# EAGLE schematic board (EAGLE 9.5.2)

## Sheet 1 of 2: USB
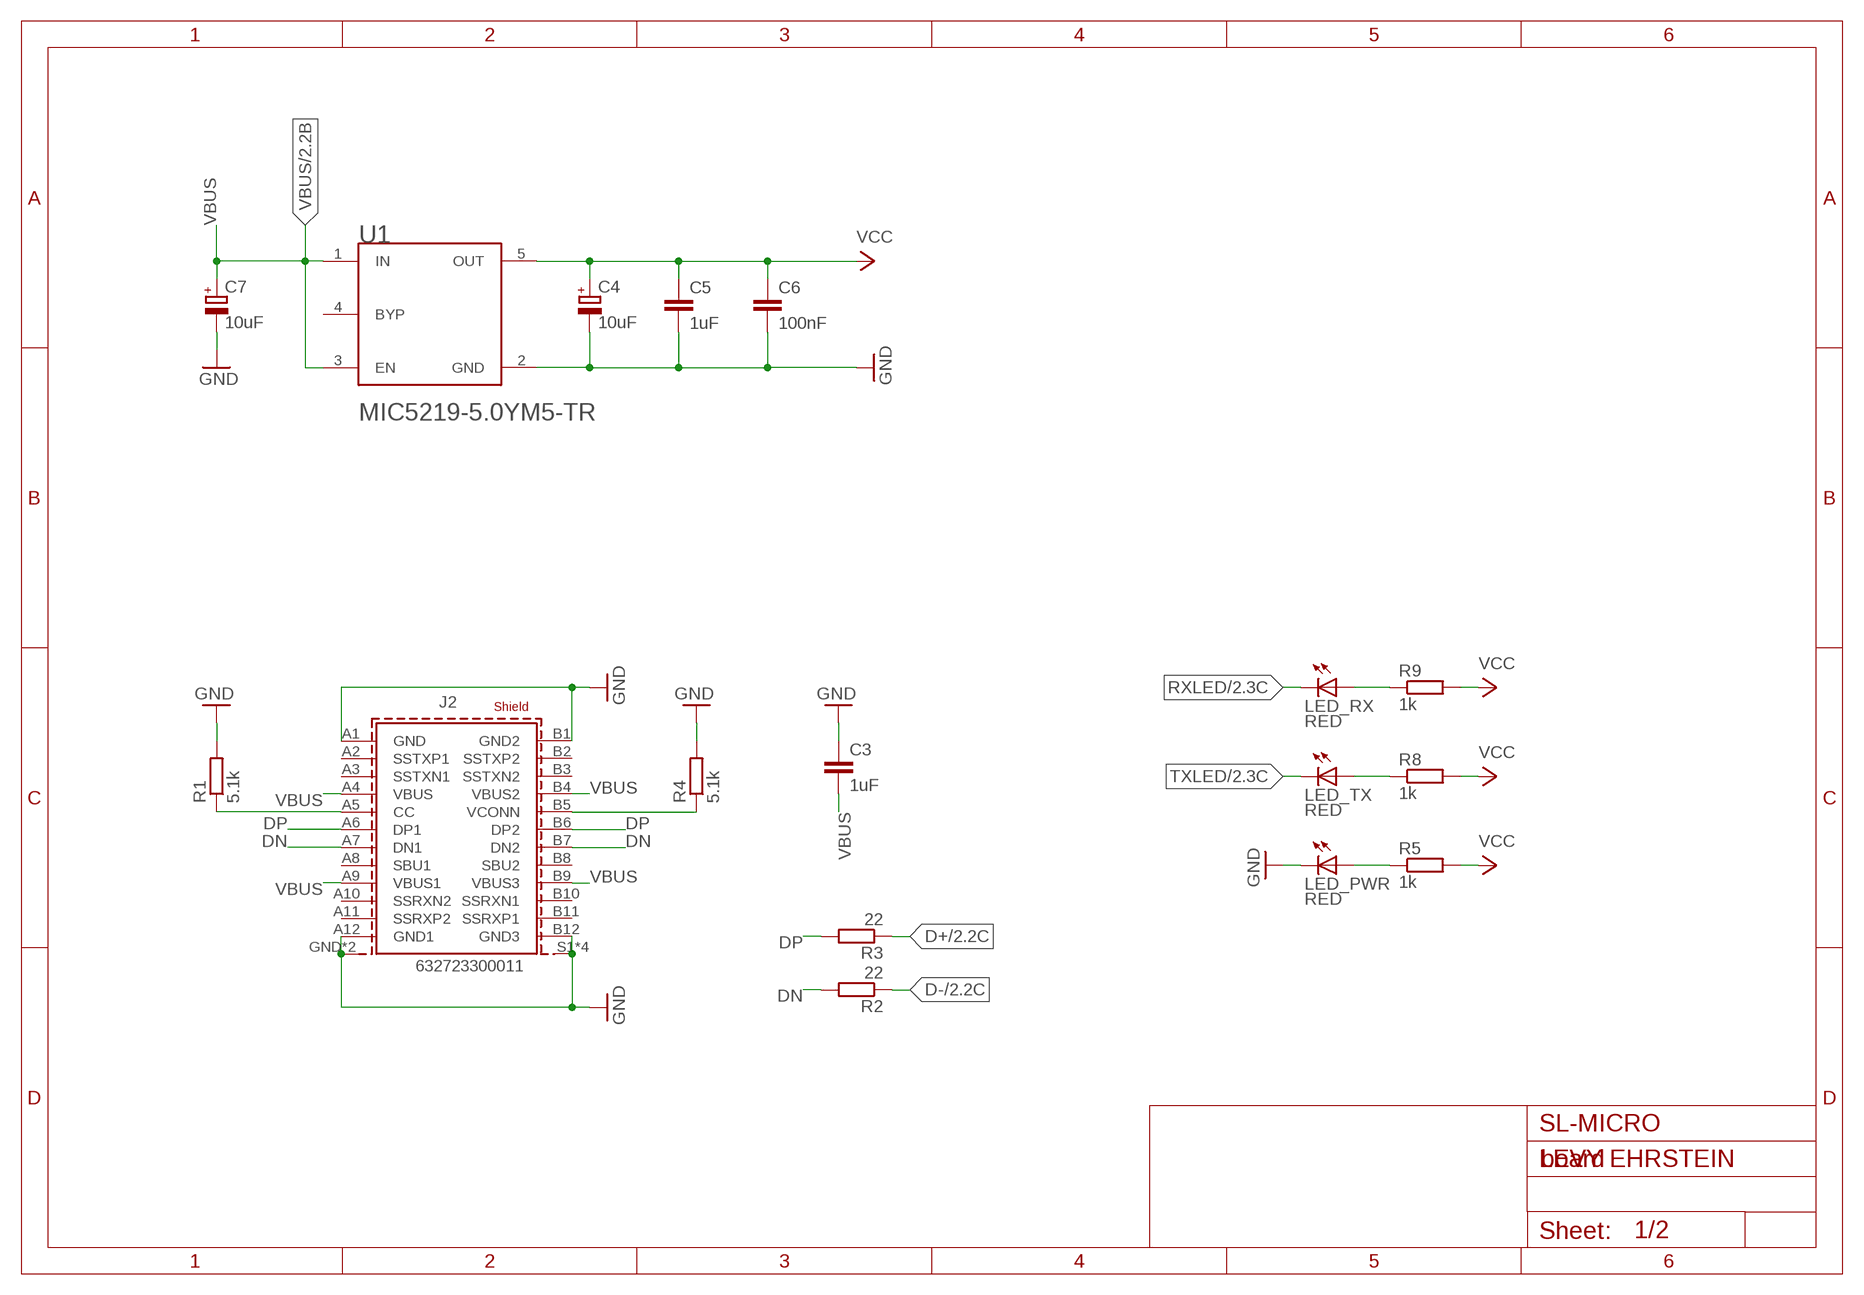
[diagram p0: schematic, sheet 1]

### Parts
C3  1uF  C-EUC0805  [C0805]
C4  10uF  CPOL-EUSMCB  [SMC_B]
C5  1uF  C-EUC0805  [C0805]
C6  100nF  C-EUC0805  [C0805]
C7  10uF  CPOL-EUSMCB  [SMC_B]
J2  632723300011  632723300011  [632723300011]
LED_PWR  RED  LEDCHIP-LED0805  [CHIP-LED0805]
LED_RX  RED  LEDCHIP-LED0805  [CHIP-LED0805]
LED_TX  RED  LEDCHIP-LED0805  [CHIP-LED0805]
R1  5.1k  R-EU_R0805  [R0805]
R2  22  R-EU_R0805  [R0805]
R3  22  R-EU_R0805  [R0805]
R4  5.1k  R-EU_R0805  [R0805]
R5  1k  R-EU_R0805  [R0805]
R8  1k  R-EU_R0805  [R0805]
R9  1k  R-EU_R0805  [R0805]
U1  MICROCHIP_TECHNOLOGY_MIC5219-5_0YM5-TRMICROCHIP_TECHNOLOGY_MIC5219-5_0YM5-TR_0_0  [MICROCHIP_TECHNOLOGY_MIC5219-5_0YM5-TR_0]

### Nets
D+: R3.1 ; also sheet 2
D-: R2.1 ; also sheet 2
DN: J2.A7(DN1) J2.B7(DN2) R2.2
DP: J2.A6(DP1) J2.B6(DP2) R3.2
GND: C3.1 C4.- C5.2 C6.2 C7.- J2.A1(GND) J2.A12(GND1) J2.B1(GND2) J2.B12(GND3) J2.GND1(SHIELD) J2.GND(SHIELD) J2.S1(SHIELD1) J2.S2(SHIELD1) J2.S3(SHIELD1) J2.S4(SHIELD1) LED_PWR.C R1.2 R4.2 U1.2(GND) ; also sheet 2
N$1: J2.A5(CC) R1.1
N$2: J2.B5(VCONN) R4.1
N$4: LED_PWR.A R5.1
N$11: LED_TX.A R8.1
N$12: LED_RX.A R9.1
RXLED: LED_RX.C ; also sheet 2
TXLED: LED_TX.C ; also sheet 2
VBUS: C3.2 C7.+ J2.A4(VBUS) J2.A9(VBUS1) J2.B4(VBUS2) J2.B9(VBUS3) U1.1(IN) U1.3(EN) ; also sheet 2
VCC: C4.+ C5.1 C6.1 R5.2 R8.2 R9.2 U1.5(OUT) ; also sheet 2
Unconnected: J2.A2(SSTXP1) J2.A3(SSTXN1) J2.A8(SBU1) J2.A10(SSRXN2) J2.A11(SSRXP2) J2.B2(SSTXP2) J2.B3(SSTXN2) J2.B8(SBU2) J2.B10(SSRXN1) J2.B11(SSRXP1) U1.4(BYP)

### Notes on the sheet
- SL-MICRO
- LEVY EHRSTEIN

## Sheet 2 of 2: ATMEGA
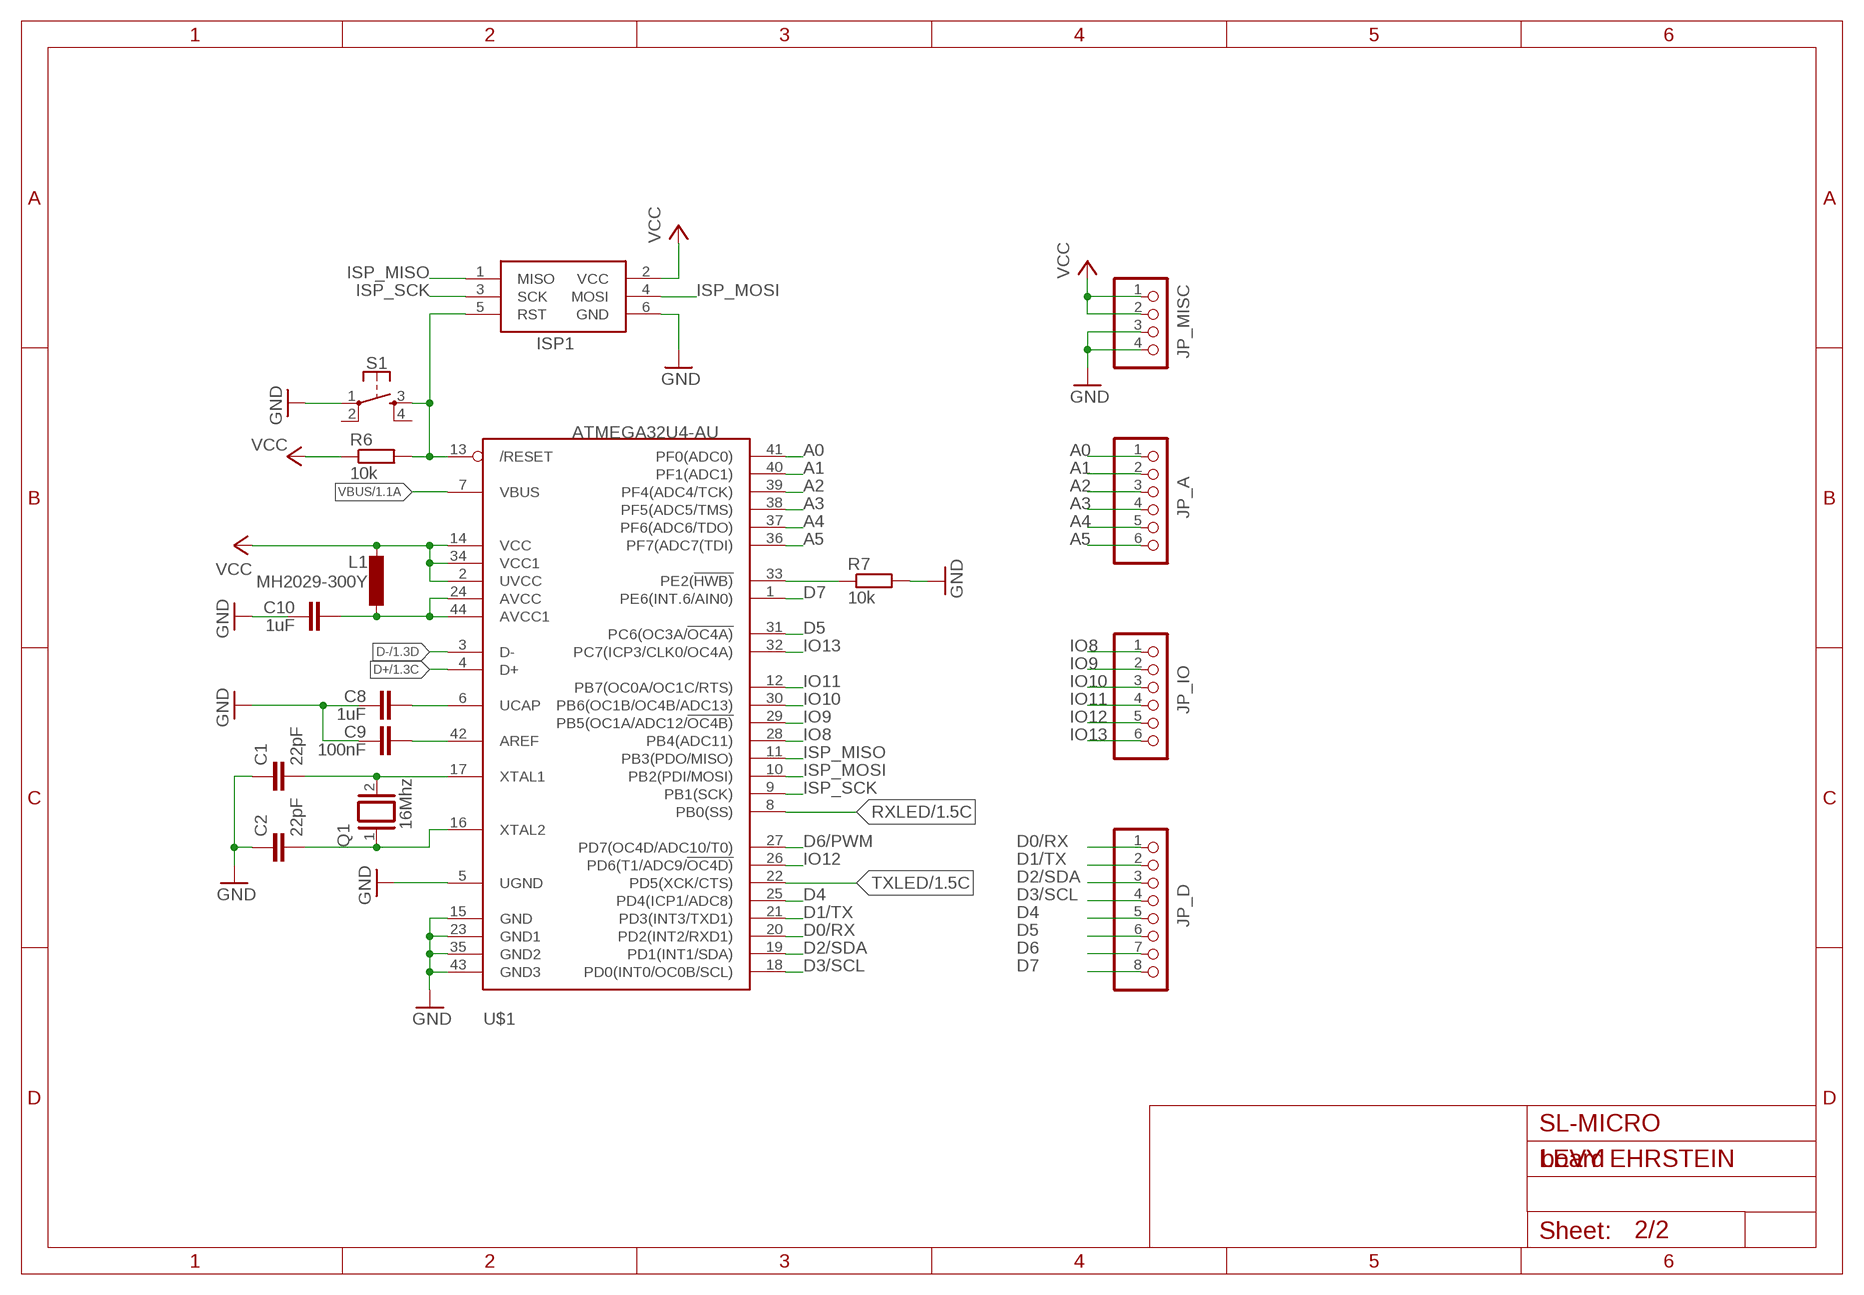
[diagram p1: schematic, sheet 2]

### Parts
C1  22pF  C-EUC0805  [C0805]
C2  22pF  C-EUC0805  [C0805]
C8  1uF  C-EUC0805  [C0805]
C9  100nF  C-EUC0805  [C0805]
C10  1uF  C-EUC0805  [C0805]
ISP1  AVRISP-6  [AVRISP]
JP_A  PINHD-1X6  [1X06]
JP_D  PINHD-1X8  [1X08]
JP_IO  PINHD-1X6  [1X06]
JP_MISC  PINHD-1X4  [1X04]
L1  MH2029-300Y  L-EUL2012C  [L2012C]
Q1  16Mhz  XTAL/S  [QS]
R6  10k  R-EU_R0805  [R0805]
R7  10k  R-EU_R0805  [R0805]
S1  MOMENTARY-SWITCH-SPST-2-SMD-4.6X2.8MM  [TACTILE_SWITCH_SMD_4.6X2.8MM]
U$1  ATMEGA32U4-AU  [TQFP44]

### Nets
A0: JP_A.1 U$1.41(PF0(ADC0))
A1: JP_A.2 U$1.40(PF1(ADC1))
A2: JP_A.3 U$1.39(PF4(ADC4/TCK))
A3: JP_A.4 U$1.38(PF5(ADC5/TMS))
A4: JP_A.5 U$1.37(PF6(ADC6/TDO))
A5: JP_A.6 U$1.36(PF7(ADC7(TDI))
D0/RX: JP_D.1 U$1.20(PD2(INT2/RXD1))
D1/TX: JP_D.2 U$1.21(PD3(INT3/TXD1))
D2/SDA: JP_D.3 U$1.19(PD1(INT1/SDA))
D3/SCL: JP_D.4 U$1.18(PD0(INT0/OC0B/SCL))
D4: JP_D.5 U$1.25(PD4(ICP1/ADC8))
D5: JP_D.6 U$1.31(PC6(OC3A/!OC4A))
D6: JP_D.7
D6/PWM: U$1.27(PD7(OC4D/ADC10/T0))
D7: JP_D.8 U$1.1(PE6(INT.6/AIN0))
D+: U$1.4(D+) ; also sheet 1
D-: U$1.3(D-) ; also sheet 1
GND: C1.1 C2.1 C8.1 C9.1 C10.1 ISP1.6(GND) JP_MISC.3 JP_MISC.4 R7.2 S1.1 U$1.5(UGND) U$1.15(GND) U$1.23(GND1) U$1.35(GND2) U$1.43(GND3) ; also sheet 1
IO8: JP_IO.1 U$1.28(PB4(ADC11))
IO9: JP_IO.2 U$1.29(PB5(OC1A/ADC12/!OC4B))
IO10: JP_IO.3 U$1.30(PB6(OC1B/OC4B/ADC13))
IO11: JP_IO.4 U$1.12(PB7(OC0A/OC1C/RTS))
IO12: JP_IO.5 U$1.26(PD6(T1/ADC9/!OC4D))
IO13: JP_IO.6 U$1.32(PC7(ICP3/CLK0/OC4A))
ISP_MISO: ISP1.1(MISO) U$1.11(PB3(PDO/MISO))
ISP_MOSI: ISP1.4(MOSI) U$1.10(PB2(PDI/MOSI))
ISP_SCK: ISP1.3(SCK) U$1.9(PB1(SCK))
N$3: C2.2 Q1.1 U$1.16(XTAL2)
N$5: ISP1.5(RST) R6.2 S1.3 U$1.13(/RESET)
N$6: C8.2 U$1.6(UCAP)
N$7: C1.2 Q1.2 U$1.17(XTAL1)
N$8: C9.2 U$1.42(AREF)
N$9: C10.2 L1.1 U$1.24(AVCC) U$1.44(AVCC1)
N$10: R7.1 U$1.33(PE2(!HWB))
RXLED: U$1.8(PB0(SS)) ; also sheet 1
TXLED: U$1.22(PD5(XCK/CTS)) ; also sheet 1
VBUS: U$1.7(VBUS) ; also sheet 1
VCC: ISP1.2(VCC) JP_MISC.1 JP_MISC.2 L1.2 R6.1 U$1.2(UVCC) U$1.14(VCC) U$1.34(VCC1) ; also sheet 1
Unconnected: S1.2 S1.4

### Notes on the sheet
- SL-MICRO
- LEVY EHRSTEIN

## Library data of the parts
C1-C3 C5 C6 C8-C10 = rcl:C-EU: CAPACITOR, European symbol; SPICEPREFIX: C
C4 C7 = rcl:CPOL-EU: POLARIZED CAPACITOR, European symbol; SPICEPREFIX: C
ISP1 = adafruit:AVRISP: AVR ISP HEADER Standard 6 pin header for AVR programming
J2 = Wurth_Connectors_WR-USB:632723300011: WR-COM USB 3.1 Type C Receptacle Horizontal THT/SMT Kind Properties Durability:10 000 Mating cycles Connector Type:USB 3.1 Type C Gender:Receptacle Type:Horizontal General Information Operating Temperature:-40up to +105 °C Compliance:RoHS Electrical Properties Working Voltage:20V (DC) Withstanding Voltage:100V (AC) Contact Resistance:30 mΩ Material Properties Insulator Material:LCP Insulator Flammability Rating:UL94 V-0 Color:Black Contact Material:Brass Contact Plating:2µ” Gold over 30µ” Pd-Ni Contact Type:Stamped Shielding Material:Steel Shielding Plating:Matte Tin <https://www.we-online.com/catalog/media/o144501v209%20Family_WR-COM_632723x00011.jpg> Details see: https://www.we-online.com/catalog/en/COM_3_1_THR_SMT_TYPE_C_RECEPTACLE_HORIZONTAL/ Updated by Ella Wu 2020-08-05 2020 (C) Würth Elektronik; APPLICATION: USB 3.1; DATASHEET-URL: https://www.we-online.com/catalog/datasheet/632723300011 .pdf; GERDER: Receptacle; INTERFACE-TYPE: Type C; IR1: 5A; MOUNT: THR; PACKAGING: Tape and Reel; PART-NUMBER: 632723300011; PINS: 24; TYPE: Horizontal; WORKING-VOLTAGE: 20V(DC)
JP_A JP_IO = pinhead:PINHD-1X6: PIN HEADER
JP_D = pinhead:PINHD-1X8: PIN HEADER
JP_MISC = pinhead:PINHD-1X4: PIN HEADER
L1 = rcl:L-EU: INDUCTOR, European symbol; SPICEPREFIX: L
LED_PWR LED_RX LED_TX = adafruit:LED: LED OSRAM: - CHIPLED LG R971, LG N971, LY N971, LG Q971, LY Q971, LO R971, LY R971 LH N974, LH R974 LS Q976, LO Q976, LY Q976 LO Q996 - Hyper CHIPLED LW Q18S LB Q993, LB Q99A, LB R99A - SideLED LS A670, LO A670, LY A670, LG A670, LP A670 LB A673, LV A673, LT A673, LW A673 LH A674 LY A675 LS A676, LA A676, LO A676, LY A676, LW A676 LS A679, LY A679, LG A679 - Hyper Micro SIDELED® LS Y876, LA Y876, LO Y876, LY Y876 LT Y87S - SmartLED LW L88C, LW L88S LB L89C, LB L89S, LG L890 LS L89K, LO L89K, LY L89K LS L896, LA L896, LO L896, LY L896 - TOPLED LS T670, LO T670, LY T670, LG T670, LP T670 LSG T670, LSP T670, LSY T670, LOP T670, LYG T670 LG T671, LOG T671, LSG T671 LB T673, LV T673, LT T673, LW T673 LH T674 LS T676, LA T676, LO T676, LY T676, LB T676, LH T676, LSB T676, LW T676 LB T67C, LV T67C, LT T67C, LS T67K, LO T67K, LY T67K, LW E67C LS E67B, LA E67B, LO E67B, LY E67B, LB E67C, LV E67C, LT E67C LW T67C LS T679, LY T679, LG T679 LS T770, LO T770, LY T770, LG T770, LP T770 LB T773, LV T773, LT T773, LW T773 LH T774 LS E675, LA E675, LY E675, LS T675 LS T776, LA T776, LO T776, LY T776, LB T776 LHGB T686 LT T68C, LB T68C - Hyper Mini TOPLED® LB M676 - Mini TOPLED Santana® LG M470 LS M47K, LO M47K, LY M47K Source: http://www.osram.convergy.de/
Q1 = special:XTAL/S: CRYSTAL
R1-R9 = rcl:R-EU_: RESISTOR, European symbol; SPICEPREFIX: R
S1 = SparkFun-Switches:MOMENTARY-SWITCH-SPST-2: Momentary Switch (Pushbutton) - SPST - Two Circuits Normally-open (NO) SPST momentary switches (buttons, pushbuttons). Schematic symbol includes two switch circuits. Variants SMD-4.6MMX2.8MM - 4.60mm x 2.80mm Tactile Momentary Button Switch - Used on SparkFun SAMD21 Mini Breakout <https://www.sparkfun.com/products/13664> SMD-5.2MM - Mini Pushbutton Switch - SMD <https://www.sparkfun.com/products/8720> - Used on Arduino Pro Mini <https://www.sparkfun.com/products/11114>; PROD_ID: SWCH-13065
U1 = Microchip Technology - MIC5219-5.0YM5-TR:MICROCHIP_TECHNOLOGY_MIC5219-5_0YM5-TR: LDO Regulator Pos 5V 0.5A 5-Pin SOT-23 T/R; ACCURACY_PERCENTAGE: 1%; AMBIENT_TEMPERATURE_RANGE_HIGH: +125°C; AMBIENT_TEMPERATURE_RANGE_LOW: -40°C; AUTOMOTIVE: No; CENTROID_NOT_SPECIFIED: No; DATASHEET: http://ww1.microchip.com/downloads/en/DeviceDoc/MIC5219-500mA-Peak-Output-LDO-Regulator-DS20006021A.pdf; DEVICE_CLASS_L1: Integrated Circuits (ICs); DEVICE_CLASS_L2: Power Management ICs; DEVICE_CLASS_L3: Voltage Regulators - Linear; DIGIKEY_DESCRIPTION: IC REG LINEAR 5V 500MA SOT23-5; DIGIKEY_PART_NUMBER: 576-2770-1-ND; DROPOUT_VOLTAGE: 350mV; FOOTPRINT_PARAMETERS_1: {"fp_type":"SOT23","params":{"N":{"default":"5","long name":"Number of leads","type":"multichoice","short name":"N"},"A":{"nom":false,"long name":"Height","min":900000,"max":1450000,"short name":"A","type":"measurement"},"A1":{"nom":false,"long name":"Package clearance","min":0,"max":150000,"short name":"A1","type":"measurement"},"A2":{"nom":1100000,"long name":"Package height","min":900000,"max":1300000,"short name":"A2","type":"measurement"},"D":{"nom":2900000,"long name":"Package length","min":2800000,"max":3000000,"short name":"D","type":"measurement"},"E":{"nom":2800000,"long name":"Width /w leads","min":2600000,"max":3000000,"short name":"E","type":"measurement"},"E1":{"nom":1600000,"long name":"Package width","min":1500000,"max":1700000,"short name":"E1","type":"measurement"},"B":{"nom":false,"long name":"Lead width","min":250000,"max":500000,"short name":"B","type":"measurement"},"C":{"nom":false,"long name":"Lead thickness","min":90000,"max":200000,"short name":"C","type":"measurement"},"L":{"nom":450000,"long name":"Lead foot length","min":350000,"max":550000,"short name":"L","type":"measurement"},"e":{"nom":950000,"long name":"Lead pitch","min":null,"max":null,"short name":"e","type":"measurement"},"PHI":{"nom":false,"long name":"Lead angle","min":0,"max":3000000,"short name":"PHI","type":"measurement"},"offset x":{"nom":0,"long name":"X Center offset","min":null,"max":null,"short name":"offset x","type":"measurement"},"offset y":{"nom":0,"long name":"Y Center offset","min":null,"max":null,"short name":"offset y","type":"measurement"},"LS":{"default":"Rounded rectangle","long name":"Land shape","type":"multichoice","short name":"LS"},"LS1":{"default":"Rectangle","long name":"Land shape (Pin 1)","type":"multichoice","short name":"LS1"},"solder toe":{"nom":550000,"long name":"Solder fillet (toe)","min":null,"max":null,"short name":"solder toe","type":"fixedmeasurement"},"solder heel":{"nom":450000,"long name":"Solder fillet (heel)","min":null,"max":null,"short name":"solder heel","type":"fixedmeasurement"},"solder side":{"nom":50000,"long name":"Solder fillet (side)","min":null,"max":null,"short name":"solder side","type":"fixedmeasurement"},"courtyard":{"nom":500000,"long name":"Courtyard","min":null,"max":null,"short name":"courtyard","type":"fixedmeasurement"},"SF":{"default":"A","long name":"Packing level","type":"multichoiceparent","short name":"SF","help":"http://support.upverter.com/customer/portal/articles/978783-what-is-a-footprint-packing-level","children":["solder toe","solder heel","solder side","courtyard"]}}}; FOOTPRINT_PARAMETERS_2: {"fp_type":"SOT23","params":{"N":{"default":"5","long name":"Number of leads","type":"multichoice","short name":"N"},"A":{"nom":false,"long name":"Height","min":900000,"max":1450000,"short name":"A","type":"measurement"},"A1":{"nom":false,"long name":"Package clearance","min":0,"max":150000,"short name":"A1","type":"measurement"},"A2":{"nom":1100000,"long name":"Package height","min":900000,"max":1300000,"short name":"A2","type":"measurement"},"D":{"nom":2900000,"long name":"Package length","min":2800000,"max":3000000,"short name":"D","type":"measurement"},"E":{"nom":2800000,"long name":"Width /w leads","min":2600000,"max":3000000,"short name":"E","type":"measurement"},"E1":{"nom":1600000,"long name":"Package width","min":1500000,"max":1700000,"short name":"E1","type":"measurement"},"B":{"nom":false,"long name":"Lead width","min":250000,"max":500000,"short name":"B","type":"measurement"},"C":{"nom":false,"long name":"Lead thickness","min":90000,"max":200000,"short name":"C","type":"measurement"},"L":{"nom":450000,"long name":"Lead foot length","min":350000,"max":550000,"short name":"L","type":"measurement"},"e":{"nom":950000,"long name":"Lead pitch","min":null,"max":null,"short name":"e","type":"measurement"},"PHI":{"nom":false,"long name":"Lead angle","min":0,"max":3000000,"short name":"PHI","type":"measurement"},"offset x":{"nom":0,"long name":"X Center offset","min":null,"max":null,"short name":"offset x","type":"measurement"},"offset y":{"nom":0,"long name":"Y Center offset","min":null,"max":null,"short name":"offset y","type":"measurement"},"LS":{"default":"Rounded rectangle","long name":"Land shape","type":"multichoice","short name":"LS"},"LS1":{"default":"Rectangle","long name":"Land shape (Pin 1)","type":"multichoice","short name":"LS1"},"solder toe":{"nom":350000,"long name":"Solder fillet (toe)","min":null,"max":null,"short name":"solder toe","type":"fixedmeasurement"},"solder heel":{"nom":350000,"long name":"Solder fillet (heel)","min":null,"max":null,"short name":"solder heel","type":"fixedmeasurement"},"solder side":{"nom":30000,"long name":"Solder fillet (side)","min":null,"max":null,"short name":"solder side","type":"fixedmeasurement"},"courtyard":{"nom":250000,"long name":"Courtyard","min":null,"max":null,"short name":"courtyard","type":"fixedmeasurement"},"SF":{"default":"B","long name":"Packing level","type":"multichoiceparent","short name":"SF","help":"http://support.upverter.com/customer/portal/articles/978783-what-is-a-footprint-packing-level","children":["solder toe","solder heel","solder side","courtyard"]}}}; FOOTPRINT_PARAMETERS_3: {"fp_type":"SOT23","params":{"N":{"default":"5","long name":"Number of leads","type":"multichoice","short name":"N"},"A":{"nom":false,"long name":"Height","min":900000,"max":1450000,"short name":"A","type":"measurement"},"A1":{"nom":false,"long name":"Package clearance","min":0,"max":150000,"short name":"A1","type":"measurement"},"A2":{"nom":1100000,"long name":"Package height","min":900000,"max":1300000,"short name":"A2","type":"measurement"},"D":{"nom":2900000,"long name":"Package length","min":2800000,"max":3000000,"short name":"D","type":"measurement"},"E":{"nom":2800000,"long name":"Width /w leads","min":2600000,"max":3000000,"short name":"E","type":"measurement"},"E1":{"nom":1600000,"long name":"Package width","min":1500000,"max":1700000,"short name":"E1","type":"measurement"},"B":{"nom":false,"long name":"Lead width","min":250000,"max":500000,"short name":"B","type":"measurement"},"C":{"nom":false,"long name":"Lead thickness","min":90000,"max":200000,"short name":"C","type":"measurement"},"L":{"nom":450000,"long name":"Lead foot length","min":350000,"max":550000,"short name":"L","type":"measurement"},"e":{"nom":950000,"long name":"Lead pitch","min":null,"max":null,"short name":"e","type":"measurement"},"PHI":{"nom":false,"long name":"Lead angle","min":0,"max":3000000,"short name":"PHI","type":"measurement"},"offset x":{"nom":0,"long name":"X Center offset","min":null,"max":null,"short name":"offset x","type":"measurement"},"offset y":{"nom":0,"long name":"Y Center offset","min":null,"max":null,"short name":"offset y","type":"measurement"},"LS":{"default":"Rounded rectangle","long name":"Land shape","type":"multichoice","short name":"LS"},"LS1":{"default":"Rectangle","long name":"Land shape (Pin 1)","type":"multichoice","short name":"LS1"},"solder toe":{"nom":150000,"long name":"Solder fillet (toe)","min":null,"max":null,"short name":"solder toe","type":"fixedmeasurement"},"solder heel":{"nom":250000,"long name":"Solder fillet (heel)","min":null,"max":null,"short name":"solder heel","type":"fixedmeasurement"},"solder side":{"nom":10000,"long name":"Solder fillet (side)","min":null,"max":null,"short name":"solder side","type":"fixedmeasurement"},"courtyard":{"nom":100000,"long name":"Courtyard","min":null,"max":null,"short name":"courtyard","type":"fixedmeasurement"},"SF":{"default":"C","long name":"Packing level","type":"multichoiceparent","short name":"SF","help":"http://support.upverter.com/customer/portal/articles/978783-what-is-a-footprint-packing-level","children":["solder toe","solder heel","solder side","courtyard"]}}}; FOOTPRINT_VARIANT_NAME_0: Recommended_Land_Pattern; FOOTPRINT_VARIANT_NAME_1: IPC_A; FOOTPRINT_VARIANT_NAME_2: IPC_B; FOOTPRINT_VARIANT_NAME_3: IPC_C; HEIGHT: 1.45mm; LEAD_FREE: Yes; MAX_JUNCTION_TEMP: +125°C; MAX_SUPPLY_VOLTAGE: 12V; MF: Microchip Technology; MFG_PACKAGE_IDENT: SOT23-5LD-PL-1; MFG_PACKAGE_IDENT_COMPONENT_ID: 354a25971f54c3a5; MFG_PACKAGE_IDENT_DATE: 0; MFG_PACKAGE_IDENT_REV: 0; MIN_SUPPLY_VOLTAGE: 2.5V; MOUSER_DESCRIPTION: IC REG LINEAR 5V 500MA SOT23-5; MOUSER_PART_NUMBER: 998-MIC5219-5.0YM5TR; MPN: MIC5219-5.0YM5-TR; NOMINAL_SUPPLY_CURRENT: 80-12000uA; NUMBER_OF_OUTPUTS: 1; OUTPUT_CURRENT: 500mA; OUTPUT_TYPE: Fixed; OUTPUT_VOLTAGE: 5V; PACKAGE: SOT23-5; PREFIX: U; ROHS: Yes; STANDOFF_HEIGHT: 0mm; TEMPERATURE_RANGE_HIGH: +125°C; TEMPERATURE_RANGE_LOW: -40°C; VERIFICATION_VERSION: 0.0.0.3
U$1 = adafruit:ATMEGA32U4: http://www.ladyada.net/library/eagle

## Net classes
0 default: width 0.508 mm
1 power: width 0.508 mm